# Altium project Project_2.PrjPcb
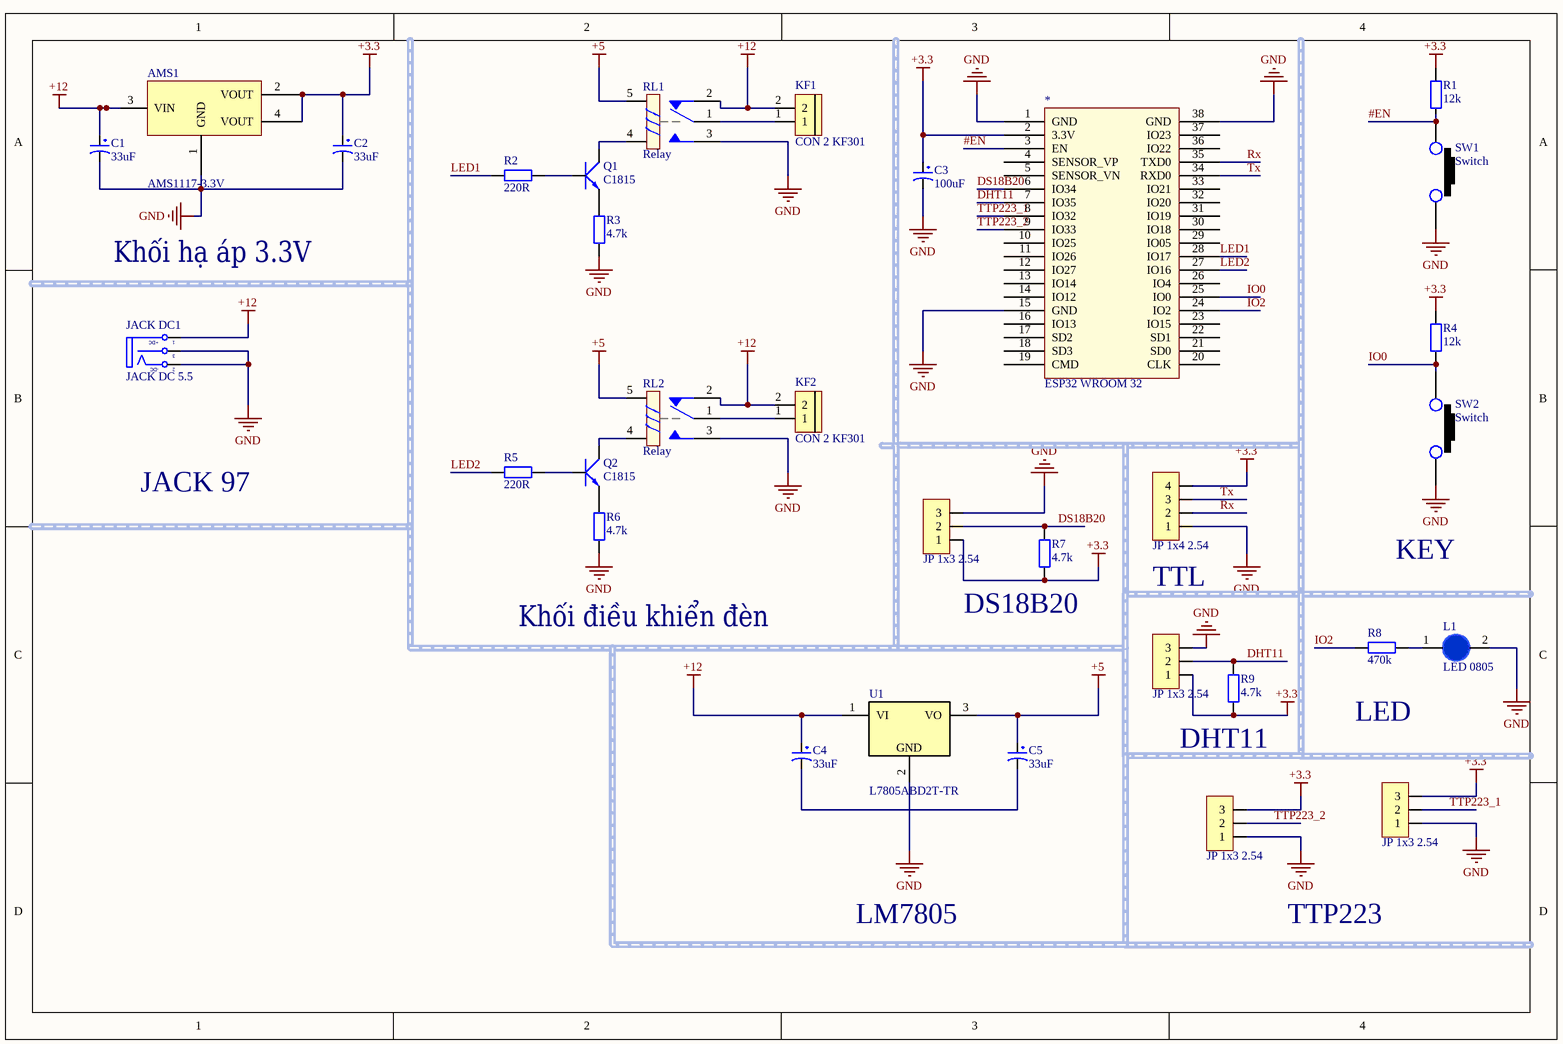
[diagram p0: Sheet2.SchDoc]
1 sheet, 32 parts. Net scope: global (net labels, ports and power ports of the same name join across sheets).
Board file: PCB2.PcbDoc

## Sheet Sheet2.SchDoc
size A4; SheetNumber: 1; SheetTotal: 1

### Parts
*  ESP32 WROOM 32  [ESP32-WROOM-32D]
AMS1  AMS1117-3.3V  [SOT223]
C1  33uF  [tu hoa 10mm]
C2  33uF  [tu hoa 10mm]
C3  100uF  [Tu hoa 10mm]
C4  33uF  [tu hoa 10mm]
C5  33uF  [tu hoa 10mm]
JACK_DC1  JACK DC 5.5  [JACK DC 5.5]
JP1  JP 1x4 2.54  [JP 1x4 DT]
JP2  JP 1x3 2.54  [JP 1x3 CT]
JP3  JP 1x3 2.54  [JP 1x3 CT]
JP4  JP 1x3 2.54  [JP 1x3 CT]
JP5  JP 1x3 2.54  [JP 1x3 CT]
KF1  CON 2 KF301  [Con 2 KF301 5.08]
KF2  CON 2 KF301  [Con 2 KF301 5.08]
L1  LED 0805  [LED-0805-Blue]
Q1  C1815  [TO92]
Q2  C1815  [TO92]
R1  12k  [tro smd 0805]
R2  220R  [tro smd 0805]
R3  4.7k  [tro vach 1/4w]
R4  12k  [tro smd 0805]
R5  220R  [tro smd 0805]
R6  4.7k  [tro vach 1/4w]
R7  4.7k  [tro smd 0805]
R8  470k  [tro smd 0805]
R9  4.7k  [tro smd 0805]
RL1  Relay  [Relay 5 Chan SRD]
RL2  Relay  [Relay 5 Chan SRD]
SW1  Switch  [SW_342_SMD]
SW2  Switch  [SW_342_SMD]
U1  L7805ABD2T-TR  [D2PAK4_94.4_433_43X133_SMD]

### Nets
+3.3: *.2(3.3V) AMS1.2(VOUT) AMS1.4(VOUT) C2.1 C3.1 JP1.4 JP2.1 JP3.1 JP4.3 JP5.3 R1.2 R4.2 R7.1 R9.1
+5: C5.1 RL1.5 RL2.5 U1.3(VO)
+12: AMS1.3(VIN) C1.1 C4.1 JACK_DC1.1(T) KF1.2 KF2.2 RL1.2 RL2.2 U1.1(VI)
GND: *.1(GND) *.15(GND) *.38(GND) AMS1.1(GND) C1.2 C2.2 C3.2 JACK_DC1.2(TN) JACK_DC1.3(S) JP1.1 JP2.3 JP3.3 JP4.1 JP5.1 L1.2(K) R3.1 R6.1 RL1.3 RL2.3 SW1.2 SW2.2 U1.2
#EN: *.3(EN) R1.1 SW1.1
DHT11: *.7(IO35) JP3.2 R9.2
DS18B20: *.6(IO34) JP2.2 R7.2
IO0: *.25(IO0) R4.1 SW2.1
IO2: *.24(IO2) R8.1
LED1: *.28(IO17) R2.1
LED2: *.27(IO16) R5.1
Rx: *.35(TXD0) JP1.2
TTP223_1: *.8(IO32) JP4.2
TTP223_2: *.9(IO33) JP5.2
Tx: *.34(RXD0) JP1.3
NetC4_2: C4.2 C5.2
NetKF1_1: KF1.1 RL1.1
NetKF2_1: KF2.1 RL2.1
NetL1_1: L1.1(A) R8.2
NetQ1_1: Q1.1(E) R3.2
NetQ1_2: Q1.2(C) RL1.4
NetQ1_3: Q1.3(B) R2.2
NetQ2_1: Q2.1(E) R6.2
NetQ2_2: Q2.2(C) RL2.4
NetQ2_3: Q2.3(B) R5.2

Not connected (* = marked no-connect by the designer): * 4(SENSOR_VP) 5(SENSOR_VN) 10(IO25) 11(IO26) 12(IO27) 13(IO14) 14(IO12) 16(IO13) 17(SD2) 18(SD3) 19(CMD) 20(CLK) 21(SD0) 22(SD1) 23(IO15) 26(IO4) 29(IO05) 30(IO18) 31(IO19) 32(IO20) 33(IO21) 36(IO22) 37(IO23)

### Notes on the sheet
- Khối hạ áp 3.3V
- JACK 97
- TTL
- KEY
- Khối điều khiển đèn
- (near R7) DS18B20
- LED
- (near R9) DHT11
- LM7805
- TTP223
- (in symbol JACK DC 5.5) +DC; -DC
- (in symbol REG_35V-5V-1.5A-7.5W-D2PAK) GND

### Library data of the parts
AMS1 = AMS1117 SMD: Dán; Value: AMS1117-3.3V SOT223; Don_Vi: Con; Ma_Hang: MH000596; Ghi_Chu: *; Kieu_Chan: *; Chung_Loai: Dán
C1 C2 C4 C5 = Tu Hoa 33uF 200V 10x20: Cắm; Don_Vi: Con; So_Chan: 2; Ten_Linh_Kien: Tụ Hóa 33uF 200V 10x20MM; Ma_Hang: MH006539; Chung_Loai: Cắm; Kieu_Chan: *
C3 = Tu Hoa 100uF 100V 10x20: Cắm; Don_Vi: Con; So_Chan: 2; Ten_Linh_Kien: Tụ Hóa 100uF 100V 10x20MM; Ma_Hang: MH003150; Chung_Loai: Cắm; Kieu_Chan: *
JACK_DC1 = JACK DC 5.5: Value: Jac DC
JP1 = JP 1x4 2.54 Duc Thang: Cắm; Ten_Linh_Kien: Jump Đơn Đực 2.54MM 1x40P Thẳng 11MM; Don_Vi: Con; Ma_Hang: MH000903; Ghi_Chu: *; Kieu_Chan: *; Chung_Loai: Cắm
JP2-JP5 = JP 1x3 2.54 Cai Thang: Cắm; Ten_Linh_Kien: Jump Đơn Cái 2.54MM 1x20P Thẳng; Don_Vi: Con; Ma_Hang: MH004006; Ghi_Chu: *; Kieu_Chan: *; Chung_Loai: Cắm
KF1 KF2 = CON 2 KF301: Cắm; Ma_Hang: MH000987; Ten_Linh_Kien: CON 2 KF301-2P 5.08MM Xanh Dương; Chung_Loai: Cắm; Ghi_Chu: *; Kieu_Chan: *; Don_Vi: Con
L1 = LED 0805 Xanh Duong: Dán; Don_Vi: Con; Ma_Hang: MH002327; Ten_Linh_Kien: LED 0805 Màu Xanh Dương (Blue); Ghi_Chu: *; Kieu_Chan: *; Chung_Loai: Dán
Q1 Q2 = Trans C1815 DIP: NPN transistor; Value: C9014
R1 R4 = Tro 0805 5% 12k: Dán; Don_Vi: Con; So_Chan: 2; Ten_Linh_Kien: Trở 0805 5% 12k; Ma_Hang: MH005241; Chung_Loai: Dán; Kieu_Chan: *
R2 R5 = Tro 0805 5% 220R: Dán; Don_Vi: Con; So_Chan: 2; Ten_Linh_Kien: Trở 0805 5% 220R; Ma_Hang: MH005259; Chung_Loai: Dán; Kieu_Chan: *
R3 R6 = Tro Vach 1/4W 5% 4.7k: Cắm; Don_Vi: Con; So_Chan: 2; Ten_Linh_Kien: Trở Vạch 1/4w 5% 4.7k; Ma_Hang: MH007317; Chung_Loai: Cắm; Kieu_Chan: *
R7 R9 = Tro 0805 5% 4.7k: Dán; Don_Vi: Con; So_Chan: 2; Ten_Linh_Kien: Trở 0805 5% 4.7k; Ma_Hang: MH005307; Chung_Loai: Dán; Kieu_Chan: *
R8 = Tro 0805 1% 470k: Dán; Don_Vi: Con; So_Chan: 2; Ten_Linh_Kien: Trở 0805 1% 470k; Ma_Hang: MH005485; Chung_Loai: Dán; Kieu_Chan: *
RL1 RL2 = Relay 5 Chan SRD: Relay 5 Chan; Ma_Hang: MH009374; Ten: Relay 5V10A SRD-05VDC-SL-C Chính Hãng
SW1 SW2 = SW1_RS-282G05A3-SMRT-SMD: Tactile Switch SPST-NO Top Actuated Surface Mount; Manufacturer: ITT C&K; Alternate Part Number-1: NA; Manufacturer Part Number: RS-282G05A3-SMRT; Case/Package: SMD; Supplier-1: SP ROAD; Supplier Part Number-1: RS-282G05A3-SMRT
U1 = REG_35V-5V-1.5A-7.5W-D2PAK: Linear Voltage Regulator IC 1 Output 1.5A D2PAK; Manufacturer: Texas Instruments; Alternate Part Number-1: NA; Manufacturer Part Number: L7805ABD2T-TR; Case/Package: D2PAK; Supplier-1: SP ROAD; Supplier Part Number-1: L7805ABD2T-TR